# EAGLE design display-header (EAGLE 6.5.0)
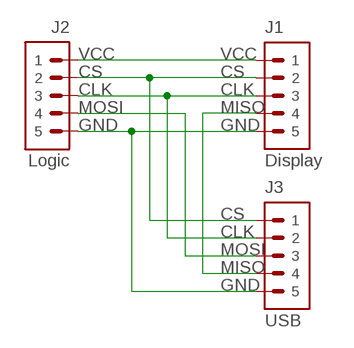
[diagram p0: schematic, sheet 1]

## Parts
J1  Display  89400-0520  [89400-0520]
J2  Logic  89400-0520  [89400-0520]
J3  USB  89400-0520  [89400-0520]

## Nets
CLK: J1.3 J2.3 J3.2
CS: J1.2 J2.2 J3.1
GND: J1.5 J2.5 J3.5
MISO: J1.4 J3.4
MOSI: J2.4 J3.3
VCC: J1.1 J2.1

## Library data of the parts
J1-J3 = con-molex-odd:89400-0520

## Board
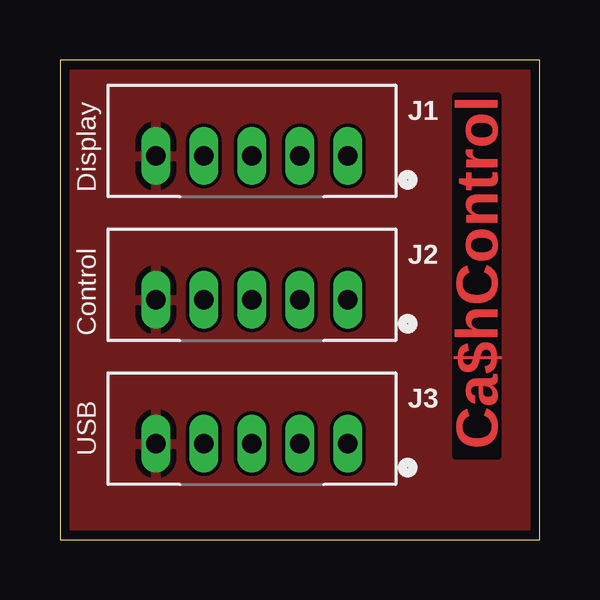
[diagram p1: board, top side]
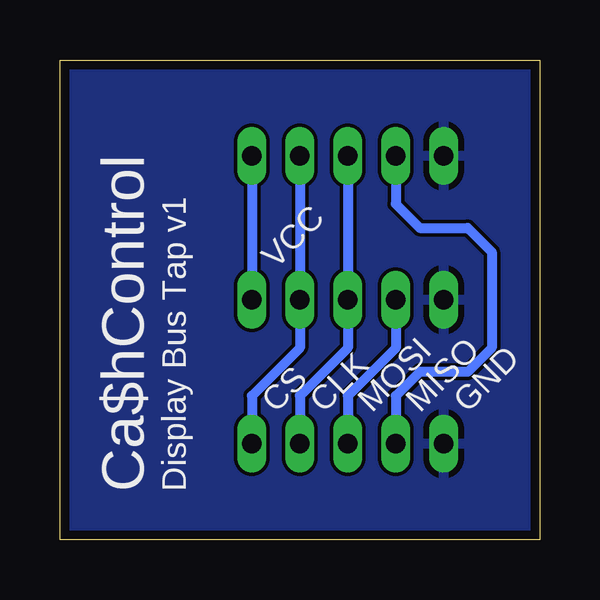
[diagram p2: board, bottom side, seen from below]

Size 20 x 20 mm. Coordinates in mm from the lower left corner, seen from the top.
Outline: 0,0 20,0 20,20 0,20 0,0
Copper layers (1*16): Top 0.0356mm / dielectric 1.5011mm / Bottom 0.0356mm
Design rules "LaenPCBOrder": minimum track width 6mil, minimum drill 13mil, track to track 6mil, track to pad 6mil, pad to pad 6mil, via to via 6mil, smd to smd 6mil, copper to edge 15mil, drill to drill 6mil, minimum pad ring 7mil, minimum via ring 7mil, stop-mask expansion 3mil, vias tented up to drill 0mil, thermal gap 10mil

### Footprints (pad centres in the part's own frame; a part is rotated, then mirrored left to right if it is on the bottom)
89400-0520 = drill 0.8 long: 1 4,0; 2 2,0; 3 0,0; 4 -2,0; 5 -4,0

### Placement (x,y rotation side)
J1  8,16 0 top
J2  8,10 0 top
J3  8,4 0 top

### Tracks (layer width: path | path; a pad name or v marks a point on that pad's centre or on a via)
CLK
  Bottom 0.406: J1.3 J2.3 8,8 10,6 J3.2
CS
  Bottom 0.406: J1.2 J2.2 10,8 12,6 J3.1
GND
  pour Bottom: 0,20 20,20 20,0 0,0
  pour Top: 0,20 20,20 20,0 0,0
MISO
  Bottom 0.406: J1.4 6,14 5,13 3,13 2,12 2,8 3,7 5,7 6,6 J3.4
MOSI
  Bottom 0.406: J2.4 6,8 8,6 J3.3
VCC
  Bottom 0.406: J1.1 J2.1

### Text on the board
Top: Ca$hControl
tPlace: Display | Control | USB
bPlace: VCC | GND | MISO | MOSI | CLK | CS | Display Bus Tap v1 | Ca$hControl
tStop: Ca$hControl